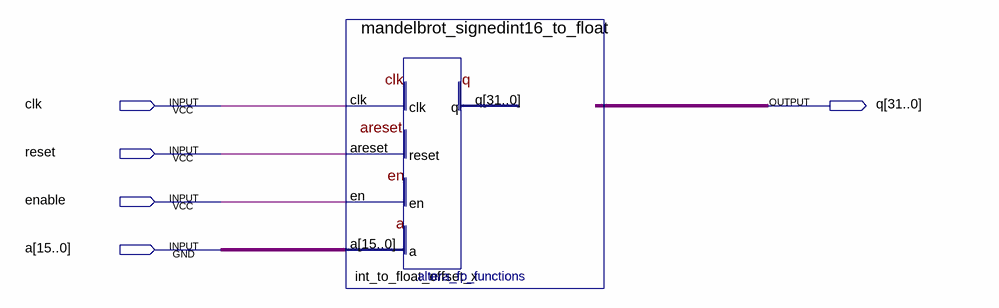
[diagram p0: schematic sheet]
// Quartus schematic signed16tofloat.bdf as structural Verilog: 1 symbols, 5 pins
module signed16tofloat (
  input  clk,
  input  reset,
  input  enable,
  input  [15:0] a,
  output [31:0] q
);

  mandelbrot_signedint16_to_float int_to_float_offset_x (.clk(clk), .areset(reset), .en(enable), .a(a), .q(q));
endmodule
